# Altium schematic sheet Connector.SchDoc
size A4; SheetNumber: 0; SheetTotal: 0
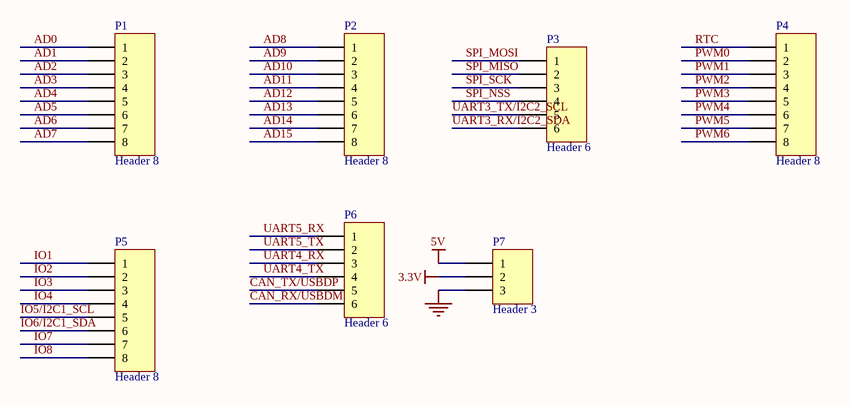
[diagram p0: Connector.SchDoc]

## Parts
P1  Header 8  [HDR1X8]
P2  Header 8  [HDR1X8]
P3  Header 6  [HDR1X6]
P4  Header 8  [HDR1X8]
P5  Header 8  [HDR1X8]
P6  Header 6  [HDR1X6]
P7  Header 3  [HDR1X3]

## Nets
3.3V: P7.2
5V: P7.1
GND: P7.3
AD0: P1.1
AD1: P1.2
AD2: P1.3
AD3: P1.4
AD4: P1.5
AD5: P1.6
AD6: P1.7
AD7: P1.8
AD8: P2.1
AD9: P2.2
AD10: P2.3
AD11: P2.4
AD12: P2.5
AD13: P2.6
AD14: P2.7
AD15: P2.8
CAN_RX/USBDM: P6.6
CAN_TX/USBDP: P6.5
IO1: P5.1
IO2: P5.2
IO3: P5.3
IO4: P5.4
IO5/I2C1_SCL: P5.5
IO6/I2C1_SDA: P5.6
IO7: P5.7
IO8: P5.8
PWM0: P4.2
PWM1: P4.3
PWM2: P4.4
PWM3: P4.5
PWM4: P4.6
PWM5: P4.7
PWM6: P4.8
RTC: P4.1
SPI_MISO: P3.2
SPI_MOSI: P3.1
SPI_NSS: P3.4
SPI_SCK: P3.3
UART3_RX/I2C2_SDA: P3.6
UART3_TX/I2C2_SCL: P3.5
UART4_RX: P6.3
UART4_TX: P6.4
UART5_RX: P6.1
UART5_TX: P6.2

## Library data of the parts
P1 P2 P4 P5 = Header 8: Header, 8-Pin; LatestRevisionDate: 17-Jul-2002; LatestRevisionNote: Re-released for DXP Platform.; Publisher: Altium Limited
P3 P6 = Header 6: Header, 6-Pin; LatestRevisionDate: 17-Jul-2002; LatestRevisionNote: Re-released for DXP Platform.; Publisher: Altium Limited
P7 = Header 3: Header, 3-Pin; LatestRevisionDate: 17-Jul-2002; LatestRevisionNote: Re-released for DXP Platform.; Publisher: Altium Limited